# EAGLE schematic PayloadBay (EAGLE 7.1.0)
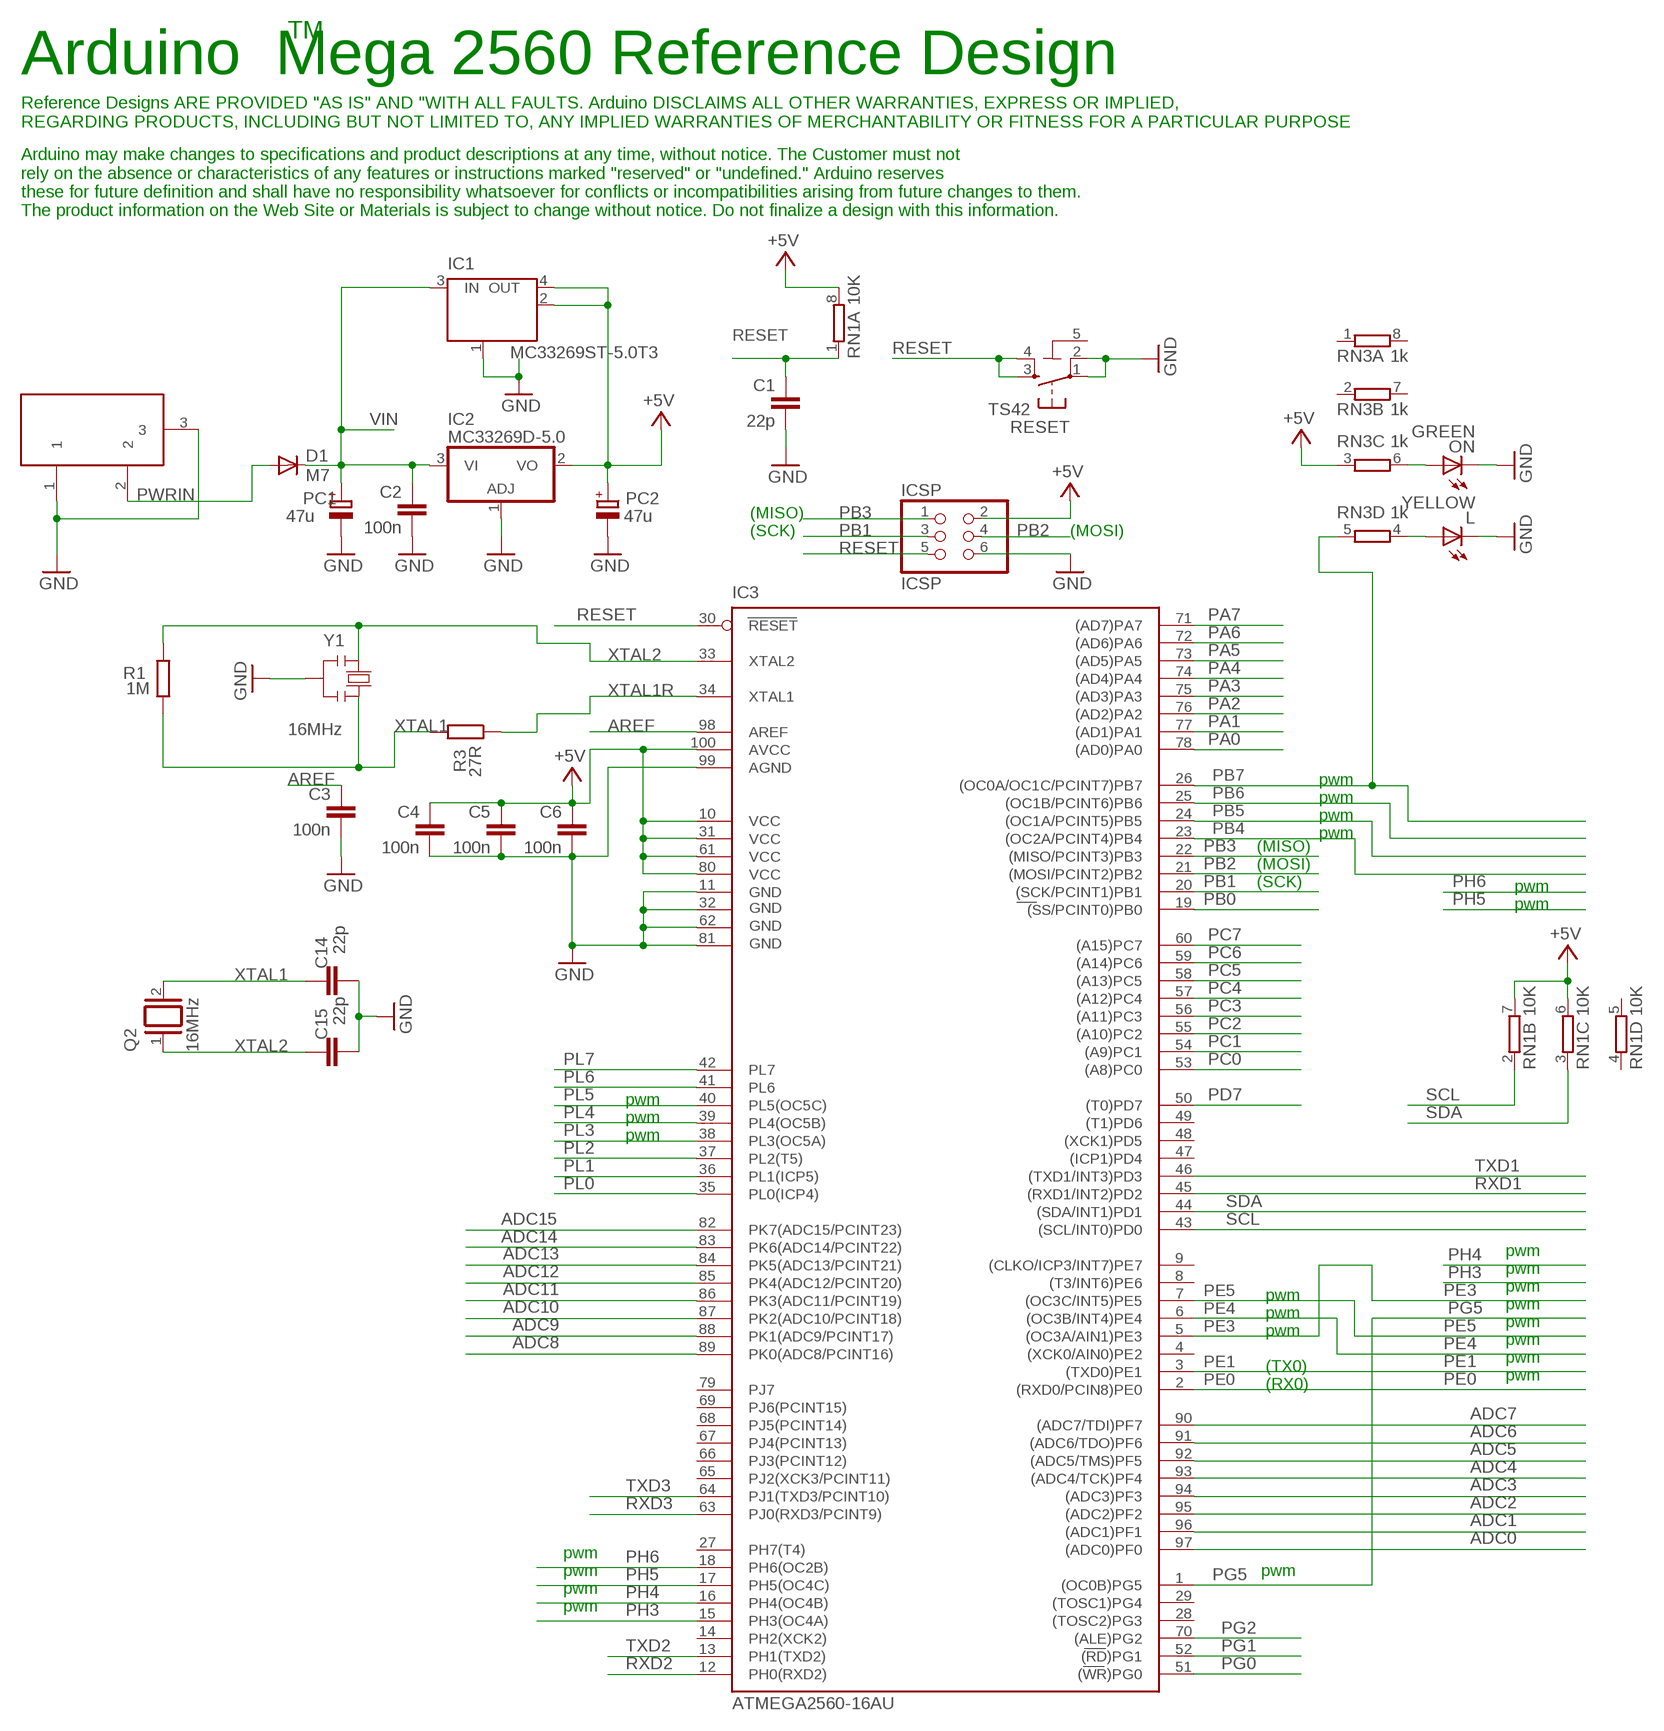
[diagram p0: schematic, sheet 1]

## Parts
C1  22p  C-EU0603-RND  [C0603-ROUND]
C2  100n  C-EU0603-RND  [C0603-ROUND]
C3  100n  C-EU0603-RND  [C0603-ROUND]
C4  100n  C-EU0603-RND  [C0603-ROUND]
C5  100n  C-EU0603-RND  [C0603-ROUND]
C6  100n  C-EU0603-RND  [C0603-ROUND]
C14  22p  C-EU0603-RND  [C0603-ROUND]
C15  22p  C-EU0603-RND  [C0603-ROUND]
D1  M7  DIODE-SMB  [SMB]
IC1  MC33269ST-5.0T3  MC33269ST-3.3T3  [SOT223]
IC2  MC33269D-5.0  [DPACK]
IC3  ATMEGA2560-16AU  ATMEGA1280-16AU  [TQFP100]
ICSP  ICSP  PINHD-2X3  [2X03]
L  YELLOW  LEDCHIP-LED0805  [CHIP-LED0805]
ON  GREEN  LEDCHIP-LED0805  [CHIP-LED0805]
PC1  47u  CPOL-EUD  [PANASONIC_D]
PC2  47u  CPOL-EUD  [PANASONIC_D]
Q2  16MHz  XTAL/S  [QS]
R1  1M  R-EU_R0603  [R0603-ROUND]
R3  27R  R-EU_R0603  [R0603-ROUND]
RESET  TS42  [TS42]
RN1  10K  4R-NCAT16  [CAT16]
RN3  1k  4R-NCAY16  [CAY16]
X1  DC21MMX  [DC-21MM]
Y1  16MHz  RESONATORMU  [RESONATOR]

## Nets
+5V: C4.1 C5.1 C6.1 IC1.2(OUT) IC1.4(OUT) IC2.2(VO) IC3.10(VCC) IC3.31(VCC1) IC3.61(VCC2) IC3.80(VCC3) IC3.100(AVCC) ICSP.2 PC2.+ RN1.6 RN1.7 RN1.8 RN3.3
ADC0: IC3.97((ADC0)PF0)
ADC1: IC3.96((ADC1)PF1)
ADC2: IC3.95((ADC2)PF2)
ADC3: IC3.94((ADC3)PF3)
ADC4: IC3.93((ADC4/TCK)PF4)
ADC5: IC3.92((ADC5/TMS)PF5)
ADC6: IC3.91((ADC6/TDO)PF6)
ADC7: IC3.90((ADC7/TDI)PF7)
ADC8: IC3.89(PK0(ADC8/PCINT16))
ADC9: IC3.88(PK1(ADC9/PCINT17))
ADC10: IC3.87(PK2(ADC10/PCINT18))
ADC11: IC3.86(PK3(ADC11/PCINT19))
ADC12: IC3.85(PK4(ADC12/PCINT20))
ADC13: IC3.84(PK5(ADC13/PCINT21))
ADC14: IC3.83(PK6(ADC14/PCINT22))
ADC15: IC3.82(PK7(ADC15/PCINT23))
AREF: C3.1 IC3.98(AREF)
GND: C1.2 C2.2 C3.2 C4.2 C5.2 C6.2 C14.1 C15.1 IC1.1(GND/ADJ) IC2.1(ADJ) IC3.11(GND) IC3.32(GND1) IC3.62(GND2) IC3.81(GND3) IC3.99(AGND) ICSP.6 L.C ON.C PC1.- PC2.- RESET.1 RESET.2 X1.1 X1.3 Y1.2
N$2: L.A RN3.4
N$3: ON.A RN3.6
PA0: IC3.78((AD0)PA0)
PA1: IC3.77((AD1)PA1)
PA2: IC3.76((AD2)PA2)
PA3: IC3.75((AD3)PA3)
PA4: IC3.74((AD4)PA4)
PA5: IC3.73((AD5)PA5)
PA6: IC3.72((AD6)PA6)
PA7: IC3.71((AD7)PA7)
PB0: IC3.19((SS/PCINT0)PB0)
PB1: IC3.20((SCK/PCINT1)PB1) ICSP.3
PB2: IC3.21((MOSI/PCINT2)PB2) ICSP.4
PB3: IC3.22((MISO/PCINT3)PB3) ICSP.1
PB4: IC3.23((OC2A/PCINT4)PB4)
PB5: IC3.24((OC1A/PCINT5)PB5)
PB6: IC3.25((OC1B/PCINT6)PB6)
PB7: IC3.26((OC0A/OC1C/PCINT7)PB7) RN3.5
PC0: IC3.53((A8)PC0)
PC1: IC3.54((A9)PC1)
PC2: IC3.55((A10)PC2)
PC3: IC3.56((A11)PC3)
PC4: IC3.57((A12)PC4)
PC5: IC3.58((A13)PC5)
PC6: IC3.59((A14)PC6)
PC7: IC3.60((A15)PC7)
PD7: IC3.50((T0)PD7)
PE0: IC3.2((RXD0/PCIN8)PE0)
PE1: IC3.3((TXD0)PE1)
PE3: IC3.5((OC3A/AIN1)PE3)
PE4: IC3.6((OC3B/INT4)PE4)
PE5: IC3.7((OC3C/INT5)PE5)
PG0: IC3.51((WR)PG0)
PG1: IC3.52((RD)PG1)
PG2: IC3.70((ALE)PG2)
PG5: IC3.1((OC0B)PG5)
PH3: IC3.15(PH3(OC4A))
PH4: IC3.16(PH4(OC4B))
PH5: IC3.17(PH5(OC4C))
PH6: IC3.18(PH6(OC2B))
PL0: IC3.35(PL0(ICP4))
PL1: IC3.36(PL1(ICP5))
PL2: IC3.37(PL2(T5))
PL3: IC3.38(PL3(OC5A))
PL4: IC3.39(PL4(OC5B))
PL5: IC3.40(PL5(OC5C))
PL6: IC3.41(PL6)
PL7: IC3.42(PL7)
PWRIN: D1.A X1.2
RESET: C1.1 IC3.30(RESET) ICSP.5 RESET.3 RESET.4 RN1.1
RXD1: IC3.45((RXD1/INT2)PD2)
RXD2: IC3.12(PH0(RXD2))
RXD3: IC3.63(PJ0(RXD3/PCINT9))
SCL: IC3.43((SCL/INT0)PD0) RN1.2
SDA: IC3.44((SDA/INT1)PD1) RN1.3
TXD1: IC3.46((TXD1/INT3)PD3)
TXD2: IC3.13(PH1(TXD2))
TXD3: IC3.64(PJ1(TXD3/PCINT10))
VIN: C2.1 D1.C IC1.3(IN) IC2.3(VI) PC1.+
XTAL1: C14.2 Q2.2 R1.1 R3.2 Y1.3
XTAL1R: IC3.34(XTAL1) R3.1
XTAL2: C15.2 IC3.33(XTAL2) Q2.1 R1.2 Y1.1
Unconnected: IC3.4((XCK0/AIN0)PE2) IC3.8((T3/INT6)PE6) IC3.9((CLKO/ICP3/INT7)PE7) IC3.14(PH2(XCK2)) IC3.27(PH7(T4)) IC3.28((TOSC2)PG3) IC3.29((TOSC1)PG4) IC3.47((ICP1)PD4) IC3.48((XCK1)PD5) IC3.49((T1)PD6) IC3.65(PJ2(XCK3/PCINT11)) IC3.66(PJ3(PCINT12)) IC3.67(PJ4(PCINT13)) IC3.68(PJ5(PCINT14)) IC3.69(PJ6(PCINT15)) IC3.79(PJ7) RN1.4 RN1.5 RN3.1 RN3.2 RN3.7 RN3.8

## Notes on the sheet
- TM
- Arduino  Mega 2560 Reference Design
- Reference Designs ARE PROVIDED "AS IS" AND "WITH ALL FAULTS. Arduino DISCLAIMS ALL OTHER WARRANTIES, EXPRESS OR IMPLIED,
  REGARDING PRODUCTS, INCLUDING BUT NOT LIMITED TO, ANY IMPLIED WARRANTIES OF MERCHANTABILITY OR FITNESS FOR A PARTICULAR PURPOSE
- Arduino may make changes to specifications and product descriptions at any time, without notice. The Customer must not
  rely on the absence or characteristics of any features or instructions marked "reserved" or "undefined." Arduino reserves
  these for future definition and shall have no responsibility whatsoever for conflicts or incompatibilities arising from future changes to them.
  The product information on the Web Site or Materials is subject to change without notice. Do not finalize a design with this information.
- (MISO)
- (SCK) | (MOSI)
- pwm
- pwm
- pwm
- pwm
- (MISO)
- (MOSI)
- (SCK) | pwm
- pwm
- pwm
- pwm
- pwm
- pwm
- pwm
- pwm
- pwm
- pwm
- pwm
- pwm
- pwm
- pwm
- pwm
- (TX0)
- pwm
- (RX0)
- pwm
- pwm | pwm
- pwm
- pwm

## Power pins joined to a net without a drawn wire
5-GND: RESET.5(5-GND)

## Library data of the parts
C1-C6 C14 C15 = SmartPrj:C-EU: CAPACITOR, European symbol
D1 = diode:DIODE-: DIODE
IC1 = linear:MC33269ST*: Adjustable Output Low Dropout Voltage Regulator 800 mA Source: http://www.onsemi.com/pub/Collateral/MC33269-D.PDF
IC2 = linear:MC33269?*: Adjustable Output Low Dropout Voltage Regulator 800 mA Source: http://www.onsemi.com/pub/Collateral/MC33269-D.PDF
IC3 = atmel-2005:ATMEGA*: MICROCONTROLLER 64/128/256 Kbytes FLASH 4 Kbytes EEPROM 8 Kbytes SRAM 86 General Purpose I/O pins 12-channels16-bit PWM 4 x Serial USARTs 16-channels 10-bit A/D
ICSP = pinhead:PINHD-2X3: PIN HEADER
L ON = led:LED: LED OSRAM: - CHIPLED LG R971, LG N971, LY N971, LG Q971, LY Q971, LO R971, LY R971 LH N974, LH R974 LS Q976, LO Q976, LY Q976 LO Q996 - Hyper CHIPLED LW Q18S LB Q993, LB Q99A, LB R99A - SideLED LS A670, LO A670, LY A670, LG A670, LP A670 LB A673, LV A673, LT A673, LW A673 LH A674 LY A675 LS A676, LA A676, LO A676, LY A676, LW A676 LS A679, LY A679, LG A679 - Hyper Micro SIDELED® LS Y876, LA Y876, LO Y876, LY Y876 LT Y87S - SmartLED LW L88C, LW L88S LB L89C, LB L89S, LG L890 LS L89K, LO L89K, LY L89K LS L896, LA L896, LO L896, LY L896 - TOPLED LS T670, LO T670, LY T670, LG T670, LP T670 LSG T670, LSP T670, LSY T670, LOP T670, LYG T670 LG T671, LOG T671, LSG T671 LB T673, LV T673, LT T673, LW T673 LH T674 LS T676, LA T676, LO T676, LY T676, LB T676, LH T676, LSB T676, LW T676 LB T67C, LV T67C, LT T67C, LS T67K, LO T67K, LY T67K, LW E67C LS E67B, LA E67B, LO E67B, LY E67B, LB E67C, LV E67C, LT E67C LW T67C LS T679, LY T679, LG T679 LS T770, LO T770, LY T770, LG T770, LP T770 LB T773, LV T773, LT T773, LW T773 LH T774 LS E675, LA E675, LY E675, LS T675 LS T776, LA T776, LO T776, LY T776, LB T776 LHGB T686 LT T68C, LB T68C - Hyper Mini TOPLED® LB M676 - Mini TOPLED Santana® LG M470 LS M47K, LO M47K, LY M47K Source: http://www.osram.convergy.de LUXEON: - LUMILED® LXK2-PW12-R00, LXK2-PW12-S00, LXK2-PW14-U00, LXK2-PW14-V00 LXK2-PM12-R00, LXK2-PM12-S00, LXK2-PM14-U00 LXK2-PE12-Q00, LXK2-PE12-R00, LXK2-PE12-S00, LXK2-PE14-T00, LXK2-PE14-U00 LXK2-PB12-K00, LXK2-PB12-L00, LXK2-PB12-M00, LXK2-PB14-N00, LXK2-PB14-P00, LXK2-PB14-Q00 LXK2-PR12-L00, LXK2-PR12-M00, LXK2-PR14-Q00, LXK2-PR14-R00 LXK2-PD12-Q00, LXK2-PD12-R00, LXK2-PD12-S00 LXK2-PH12-R00, LXK2-PH12-S00 LXK2-PL12-P00, LXK2-PL12-Q00, LXK2-PL12-R00 Source: www.luxeon.com KINGBRIGHT: KA-3528ASYC Source: www.kingbright.com
PC1 PC2 = rcl:CPOL-EU: POLARIZED CAPACITOR, European symbol
Q2 = special:XTAL/S: CRYSTAL
R1 R3 = SmartPrj:R-EU_: RESISTOR, European symbol
RESET = st-mod v1.4:TS42: TS42 Dongnan Electronics Tact switch VDC 12V - 50mA
RN1 RN3 = resistor-dil:4R-N: Array Chip Resistor Source: RS Component / Phycomp
X1 = powersupply:DC21MM
Y1 = SmartPrj:RESONATOR

## Net classes
0 default: width 0.152 mm, drill 0.305 mm, clearance 0.152 mm